# Altium schematic sheet SCH.SchDoc
size 457 x 330 mm; SheetNumber: 1; SheetTotal: 1
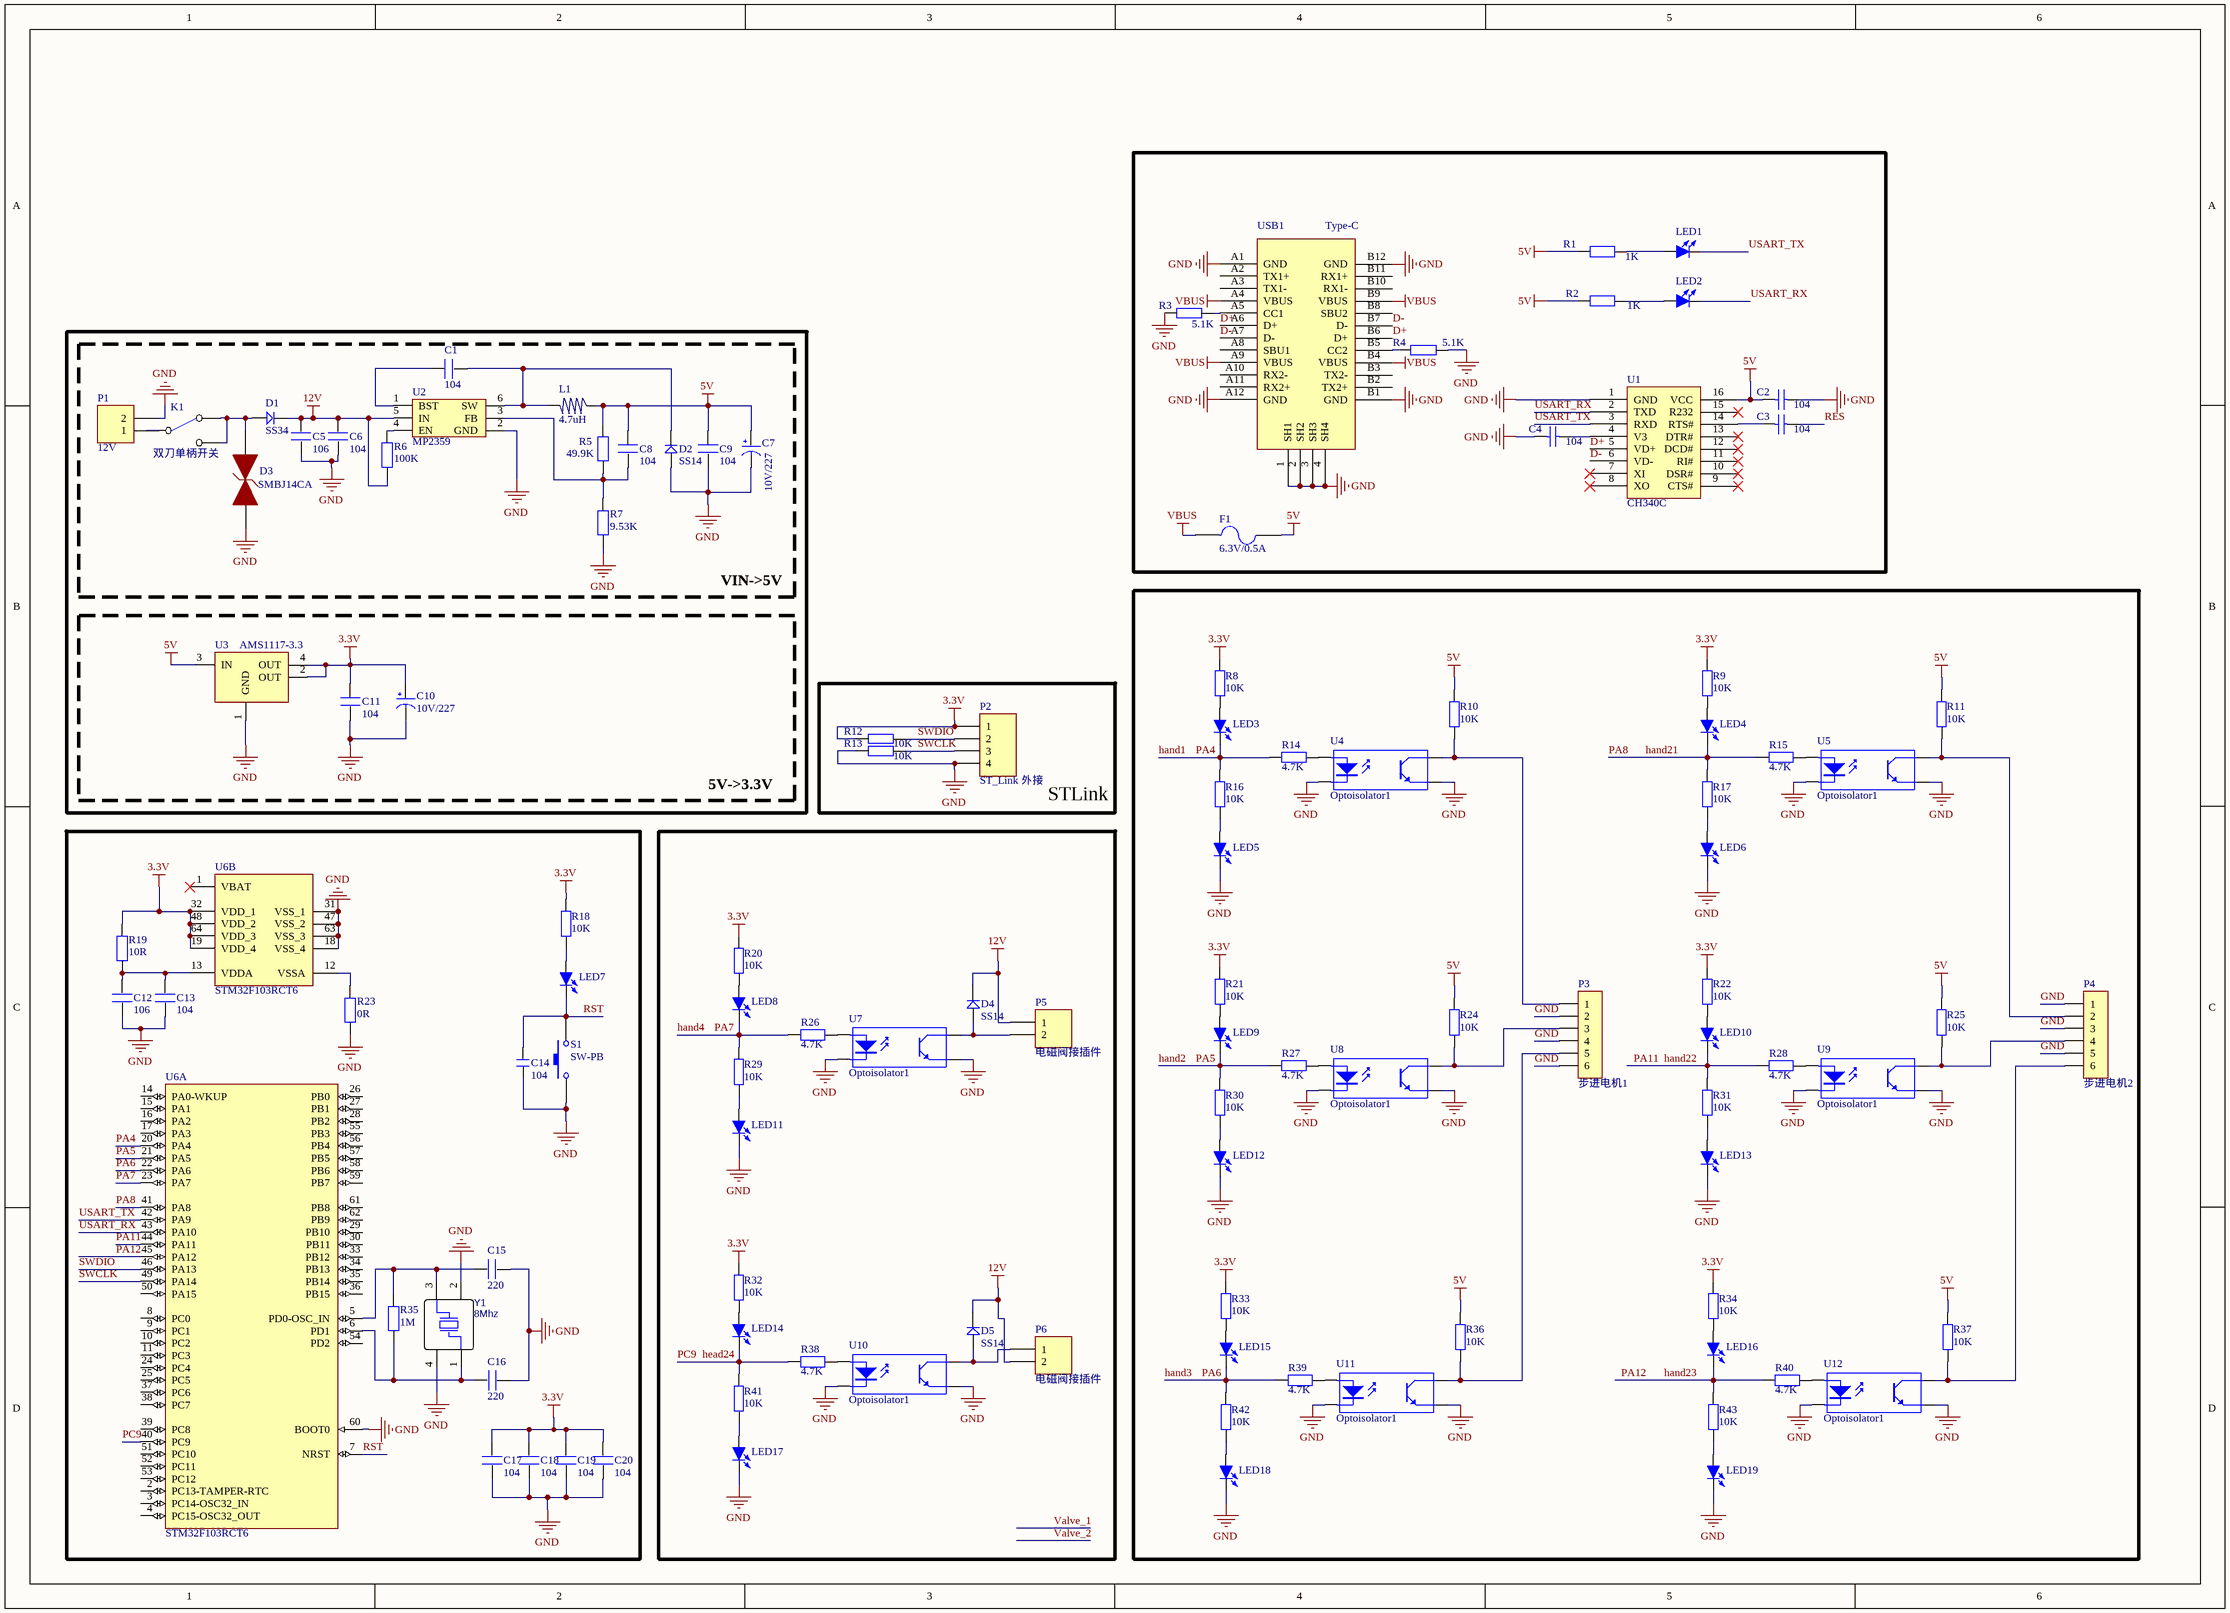
[diagram p0: SCH.SchDoc]

## Parts
C1  104  [C 0805_L]
C2  104  [C 0805_L]
C3  104  [C 0805_L]
C4  104  [C 0805_L]
C5  106  [C 0805_L]
C6  104  [C 0805_L]
C7  10V/227  [CM D(6.3*7.7)]
C8  104  [C 0805_L]
C9  104  [C 0805_L]
C10  10V/227  [CM D(6.3*7.7)]
C11  104  [C 0805_L]
C12  106  [C 0805_L]
C13  104  [C 0805_L]
C14  104  [C 0805_L]
C15  220  [C 0805_L]
C16  220  [C 0805_L]
C17  104  [C 0805_L]
C18  104  [C 0805_L]
C19  104  [C 0805_L]
C20  104  [C 0805_L]
D1  SS34  [SMA]
D2  SS14  [SMA]
D3  SMBJ14CA  [SMB/DO214AA]
D4  SS14  [SMA]
D5  SS14  [SMA]
F1  6.3V/0.5A  [C 0805_L]
K1  双刀单柄开关  [SS-12D10]
L1  4.7uH  [CDRH74]
LED1  (no value)  [LED 0805R]
LED2  (no value)  [LED 0805R]
LED3  (no value)  [LED 0805R]
LED4  (no value)  [LED 0805R]
LED5  (no value)  [LED 0805R]
LED6  (no value)  [LED 0805R]
LED7  (no value)  [LED 0805R]
LED8  (no value)  [LED 0805R]
LED9  (no value)  [LED 0805R]
LED10  (no value)  [LED 0805R]
LED11  (no value)  [LED 0805R]
LED12  (no value)  [LED 0805R]
LED13  (no value)  [LED 0805R]
LED14  (no value)  [LED 0805R]
LED15  (no value)  [LED 0805R]
LED16  (no value)  [LED 0805R]
LED17  (no value)  [LED 0805R]
LED18  (no value)  [LED 0805R]
LED19  (no value)  [LED 0805R]
P1  12V  [KF128-5.08-2P]
P2  ST_Link 外接  [HDR1X4]
P3  步进电机1  [KF128-5.08-6P]
P4  步进电机2  [KF128-5.08-6P]
P5  电磁阀接插件  [KF128-5.08-2P]
P6  电磁阀接插件  [KF128-5.08-2P]
R1  1K  [R 0805_L]
R2  1K  [R 0805_L]
R3  5.1K  [R 0805_L]
R4  5.1K  [R 0805_L]
R5  49.9K  [R 0805_L]
R6  100K  [R 0805_L]
R7  9.53K  [R 0805_L]
R8  10K  [R 0805_L]
R9  10K  [R 0805_L]
R10  10K  [R 0805_L]
R11  10K  [R 0805_L]
R12  10K  [R 0805_L]
R13  10K  [R 0805_L]
R14  4.7K  [R 0805_L]
R15  4.7K  [R 0805_L]
R16  10K  [R 0805_L]
R17  10K  [R 0805_L]
R18  10K  [R 0805_L]
R19  10R  [R 0805_L]
R20  10K  [R 0805_L]
R21  10K  [R 0805_L]
R22  10K  [R 0805_L]
R23  0R  [R 0805_L]
R24  10K  [R 0805_L]
R25  10K  [R 0805_L]
R26  4.7K  [R 0805_L]
R27  4.7K  [R 0805_L]
R28  4.7K  [R 0805_L]
R29  10K  [R 0805_L]
R30  10K  [R 0805_L]
R31  10K  [R 0805_L]
R32  10K  [R 0805_L]
R33  10K  [R 0805_L]
R34  10K  [R 0805_L]
R35  1M  [R 0805_L]
R36  10K  [R 0805_L]
R37  10K  [R 0805_L]
R38  4.7K  [R 0805_L]
R39  4.7K  [R 0805_L]
R40  4.7K  [R 0805_L]
R41  10K  [R 0805_L]
R42  10K  [R 0805_L]
R43  10K  [R 0805_L]
S1  SW-PB  [复位按键]
U1  CH340C  [SOP16]
U2  MP2359  [SOT23-6L]
U3  AMS1117-3.3  [SOT223_L]
U4  Optoisolator1  [SOP4-W2.54_M]
U5  Optoisolator1  [SOP4-W2.54_M]
U6  STM32F103RCT6  [LQFP64_N]  (parts A,B of 2)
U7  Optoisolator1  [SOP4-W2.54_M]
U8  Optoisolator1  [SOP4-W2.54_M]
U9  Optoisolator1  [SOP4-W2.54_M]
U10  Optoisolator1  [SOP4-W2.54_M]
U11  Optoisolator1  [SOP4-W2.54_M]
U12  Optoisolator1  [SOP4-W2.54_M]
USB1  Type-C  [USBTypeC-16P]
Y1  8Mhz  [OSC 5032-4P]

## Blocks framed on the sheet
VIN->5V: C1 C5-C9 D1-D3 K1 L1 P1 R5-R7 U2
5V->3.3V: C10 C11 U3
STLink: P2 R12 R13

## Nets
3.3V: C10.1(VCC) C11.2 C17.2 C18.2 C19.2 C20.2 P2.1 R8.1 R9.1 R12.2 R18.1 R19.2 R20.1 R21.1 R22.1 R32.1 R33.1 R34.1 U3.2(OUT) U3.4(OUT) U6.19(VDD_4) U6.32(VDD_1) U6.48(VDD_2) U6.64(VDD_3)
5V: C2.2 C7.1(VCC) C8.2 C9.2 F1.2 L1.1 R1.2 R2.2 R5.2 R10.1 R11.1 R24.1 R25.1 R36.1 R37.1 U1.16(VCC) U3.3(IN)
12V: C5.2 C6.2 D1.2 D4.2 D5.2 P5.1 P6.2 R6.2 U2.5(IN)
GND: C2.1 C4.2 C5.1 C6.1 C7.2(GND) C9.1 C10.2(GND) C11.1 C12.2 C13.2 C14.1 C15.2 C16.1 C17.1 C18.1 C19.1 C20.1 D2.1 D3.1 LED5.2(K) LED6.2(K) LED11.2(K) LED12.2(K) LED13.2(K) LED17.2(K) LED18.2(K) LED19.2(K) P1.2 P2.4 P3.2 P3.4 P3.6 P4.1 P4.3 P4.5 R3.1 R4.2 R7.1 R13.2 R23.1 S1.1 U1.1(GND) U2.2(GND) U3.1(GND) U4.2(K) U4.3(E) U5.2(K) U5.3(E) U6.18(VSS_4) U6.31(VSS_1) U6.47(VSS_2) U6.60(BOOT0) U6.63(VSS_3) U7.2(K) U7.3(E) U8.2(K) U8.3(E) U9.2(K) U9.3(E) U10.2(K) U10.3(E) U11.2(K) U11.3(E) U12.2(K) U12.3(E) USB1.1(SH1) USB1.2(SH2) USB1.3(SH3) USB1.4(SH4) USB1.A1(GND) USB1.A12(GND) USB1.B1(GND) USB1.B12(GND) Y1.2(GND) Y1.4(GND)
VBUS: F1.1 USB1.A4(VBUS) USB1.A9(VBUS) USB1.B4(VBUS) USB1.B9(VBUS)
D+: U1.5(VD+) USB1.A6(D+) USB1.B6(D+)
D-: U1.6(VD-) USB1.A7(D-) USB1.B7(D-)
hand1: LED3.2(K) R14.1 R16.1 U6.20(PA4)  [also labelled PA4]
hand2: LED9.2(K) R27.1 R30.1 U6.21(PA5)  [also labelled PA5]
hand3: LED15.2(K) R39.1 R42.1 U6.22(PA6)  [also labelled PA6]
hand4: LED8.2(K) R26.1 R29.1 U6.23(PA7)  [also labelled PA7]
hand21: LED4.2(K) R15.1 R17.1 U6.41(PA8)  [also labelled PA8]
hand22: LED10.2(K) R28.1 R31.1 U6.44(PA11)  [also labelled PA11]
hand23: LED16.2(K) R40.1 R43.1 U6.45(PA12)  [also labelled PA12]
head24: LED14.2(K) R38.1 R41.1 U6.40(PC9)  [also labelled PC9]
RES: C3.1
RST: C14.2 LED7.2(K) S1.2 U6.7(NRST)
SWCLK: P2.3 R13.1 U6.49(PA14)
SWDIO: P2.2 R12.1 U6.46(PA13)
USART_RX: LED2.2(K) U1.2(TXD) U6.43(PA10)
USART_TX: LED1.2(K) U1.3(RXD) U6.42(PA9)
NetC1_1: C1.1 U2.1(BST)
NetC1_2: C1.2 D2.2 L1.2 U2.6(SW)
NetC3_2: C3.2 U1.14(RTS#)
NetC4_1: C4.1 U1.4(V3)
NetC8_1: C8.1 R5.1 R7.2 U2.3(FB)
NetC12_1: C12.1 C13.1 R19.1 U6.13(VDDA)
NetC15_1: C15.1 R35.2 U6.5(PD0-OSC_IN) Y1.3(OSC2)
NetC16_2: C16.2 R35.1 U6.6(PD1) Y1.1(OSC1)
NetD1_1: D1.1 D3.2 K1.2(NC) K1.3(NO)
NetD4_1: D4.1 P5.2 U7.4(C)
NetD5_1: D5.1 P6.1 U10.4(C)
NetK1_1: K1.1(COMMON) P1.1
NetLED1_1: LED1.1(A) R1.1
NetLED2_1: LED2.1(A) R2.1
NetLED3_1: LED3.1(A) R8.2
NetLED4_1: LED4.1(A) R9.2
NetLED5_1: LED5.1(A) R16.2
NetLED6_1: LED6.1(A) R17.2
NetLED7_1: LED7.1(A) R18.2
NetLED8_1: LED8.1(A) R20.2
NetLED9_1: LED9.1(A) R21.2
NetLED10_1: LED10.1(A) R22.2
NetLED11_1: LED11.1(A) R29.2
NetLED12_1: LED12.1(A) R30.2
NetLED13_1: LED13.1(A) R31.2
NetLED14_1: LED14.1(A) R32.2
NetLED15_1: LED15.1(A) R33.2
NetLED16_1: LED16.1(A) R34.2
NetLED17_1: LED17.1(A) R41.2
NetLED18_1: LED18.1(A) R42.2
NetLED19_1: LED19.1(A) R43.2
NetP3_1: P3.1 R10.2 U4.4(C)
NetP3_3: P3.3 R24.2 U8.4(C)
NetP3_5: P3.5 R36.2 U11.4(C)
NetP4_2: P4.2 R11.2 U5.4(C)
NetP4_4: P4.4 R25.2 U9.4(C)
NetP4_6: P4.6 R37.2 U12.4(C)
NetR3_2: R3.2 USB1.A5(CC1)
NetR4_1: R4.1 USB1.B5(CC2)
NetR6_1: R6.1 U2.4(EN)
NetR14_2: R14.2 U4.1(A)
NetR15_2: R15.2 U5.1(A)
NetR23_2: R23.2 U6.12(VSSA)
NetR26_2: R26.2 U7.1(A)
NetR27_2: R27.2 U8.1(A)
NetR28_2: R28.2 U9.1(A)
NetR38_2: R38.2 U10.1(A)
NetR39_2: R39.2 U11.1(A)
NetR40_2: R40.2 U12.1(A)

Not connected (* = marked no-connect by the designer): U1 7(XI)* 8(XO)* 9(CTS#)* 10(DSR#)* 11(RI#)* 12(DCD#)* 13(DTR#)* 15(R232)*; U6 1(VBAT)* 2(PC13-TAMPER-RTC) 3(PC14-OSC32_IN) 4(PC15-OSC32_OUT) 8(PC0) 9(PC1) 10(PC2) 11(PC3) 14(PA0-WKUP) 15(PA1) 16(PA2) 17(PA3) 24(PC4) 25(PC5) 26(PB0) 27(PB1) 28(PB2) 29(PB10) 30(PB11) 33(PB12) 34(PB13) 35(PB14) 36(PB15) 37(PC6) 38(PC7) 39(PC8) 50(PA15) 51(PC10) 52(PC11) 53(PC12) 54(PD2) 55(PB3) 56(PB4) 57(PB5) 58(PB6) 59(PB7) 61(PB8) 62(PB9); USB1 A2(TX1+) A3(TX1-) A8(SBU1) A10(RX2-) A11(RX2+) B2(TX2+) B3(TX2-) B8(SBU2) B10(RX1-) B11(RX1+)

## Library data of the parts
C1 C5 C6 C8 C9 C11-C13 C15-C20 = C
C2-C4 = Cap: Capacitor; Published: 8-Jun-2000; LatestRevisionDate: 17-Jul-2002; LatestRevisionNote: Re-released for DXP Platform.; PackageReference: RAD-0.3; Publisher: Altium Limited; PackageDescription: Radial Cap, Thru-Hole; 2 Leads; 0.3 in Pin Spacing
C7 C10 = CAP
C14 = C: 贴片电容; BOM名称: 无极性贴片电容; 淘宝ID: 封装库来自淘宝 ID：黄晶宝石; 联系售后，技术支持: https://shop463601444.taobao.com; 唯一出售店铺网址: https://shop463601444.taobao.com
D1 D2 D4 D5 = D
D3 = SMBJ28CA
F1 = Fuse 2: Fuse; Published: 8-Jun-2000; LatestRevisionDate: 17-Jul-2002; LatestRevisionNote: Re-released for DXP Platform.; PackageReference: PIN-W2/E2.8; Publisher: Altium Limited; PackageDescription: Thru-Hole; 2 Leads
L1 = L
LED1-LED19 = LED-SMD: 贴片LED; 版权归属: 封装库来自淘宝 ID：黄晶宝石; BOM名称: 贴片LED; 学习资源: https://shop463601444.taobao.com
P1 = Header 2: 12-24V; LatestRevisionDate: 17-Jul-2002; LatestRevisionNote: Re-released for DXP Platform.; Publisher: Altium Limited
P2 = Header 4: Header, 4-Pin; LatestRevisionDate: 17-Jul-2002; LatestRevisionNote: Re-released for DXP Platform.; Publisher: Altium Limited
P3 P4 = Header 6: 6P接插件; 淘宝ID: 小糖豆的小窝窝; BOM名称: 6P接插件; 下单链接: https://item.taobao.com/item.htm?ft=t&id=613637044352
P5 P6 = MHDR1X2: Header, 2-Pin; LatestRevisionDate: 17-Jul-2002; LatestRevisionNote: Re-released for DXP Platform.; Publisher: Altium Limited
R1 R2 R8-R11 R14-R18 R20-R22 R24-R34 R36-R43 = Res2: Resistor; Published: 8-Jun-2000; LatestRevisionDate: 17-Jul-2002; LatestRevisionNote: Re-released for DXP Platform.; PackageReference: AXIAL-0.4; Publisher: Altium Limited; PackageDescription: Axial Device, Thru-Hole; 2 Leads; 0.4 in Pin Spacing
R3-R7 R12 R13 R19 R23 R35 = R
S1 = SW-PB: Switch; Published: 24-Mar-1999; LatestRevisionDate: 17-Jul-2002; LatestRevisionNote: Re-released for DXP Platform.; PackageReference: SPST-2; Publisher: Altium Limited; PackageDescription: Switch; 2 Leads
U1 = CH340G
U2 = MP2359: DC DC Step Down IC
U3 = AMS1117
U4 U5 U7-U12 = Optoisolator1: 4-Pin Phototransistor Optocoupler; Published: 24-Mar-1999; LatestRevisionDate: 04-Mar-2005; LatestRevisionNote: Sch pins 3 & 4 Swapped.; DatasheetVersion: Nov-2003; PackageReference: DIP-4; Publisher: Altium Limited
U6 = STM32F103RCT6: STM32 ARM-based 32-bit MCU Performance Line with 256 kB Flash, 48 kB Internal RAM, -40 to +85癈 Temperature, 64-Pin LQFP, Tray; DatasheetVersion: rev8.0, Apr-2011; PackageVersion: rev13, Apr-2011; PackageReference: LQFP64; PackageDescription: 64-Pin Low-Profile Quad Flat Pack, 10 x 10 mm Body, 0.5 mm Pitch (LQFP64); ComponentLink1Description: Manufacturer URL; ComponentLink1URL: http://www.st.com/; ComponentLink2Description: STM32F103 Datasheet; ComponentLink2URL: http://www.st.com/internet/com/TECHNICAL_RESOURCES/TECHNICAL_LITERATURE/DATASHEET/CD00191185.pdf; ComponentLink3Description: STM32 Family Web Page; ComponentLink3URL: www.st.com/stm32
USB1 = USB-Type-C-TOP
Y1 = Y: BOM_Manufacturer: YXC; BOM_Manufacturer Part: X322516MLB4SI; nameAlias: Frequency; BOM_Supplier: LCSC; BOM_Supplier Part: C13738; BOM_JLCPCB Part Class: Basic Part; spicePre: X; spiceSymbolName: X322516MLB4SI